# EAGLE design FET_bord (EAGLE 8.2.2)
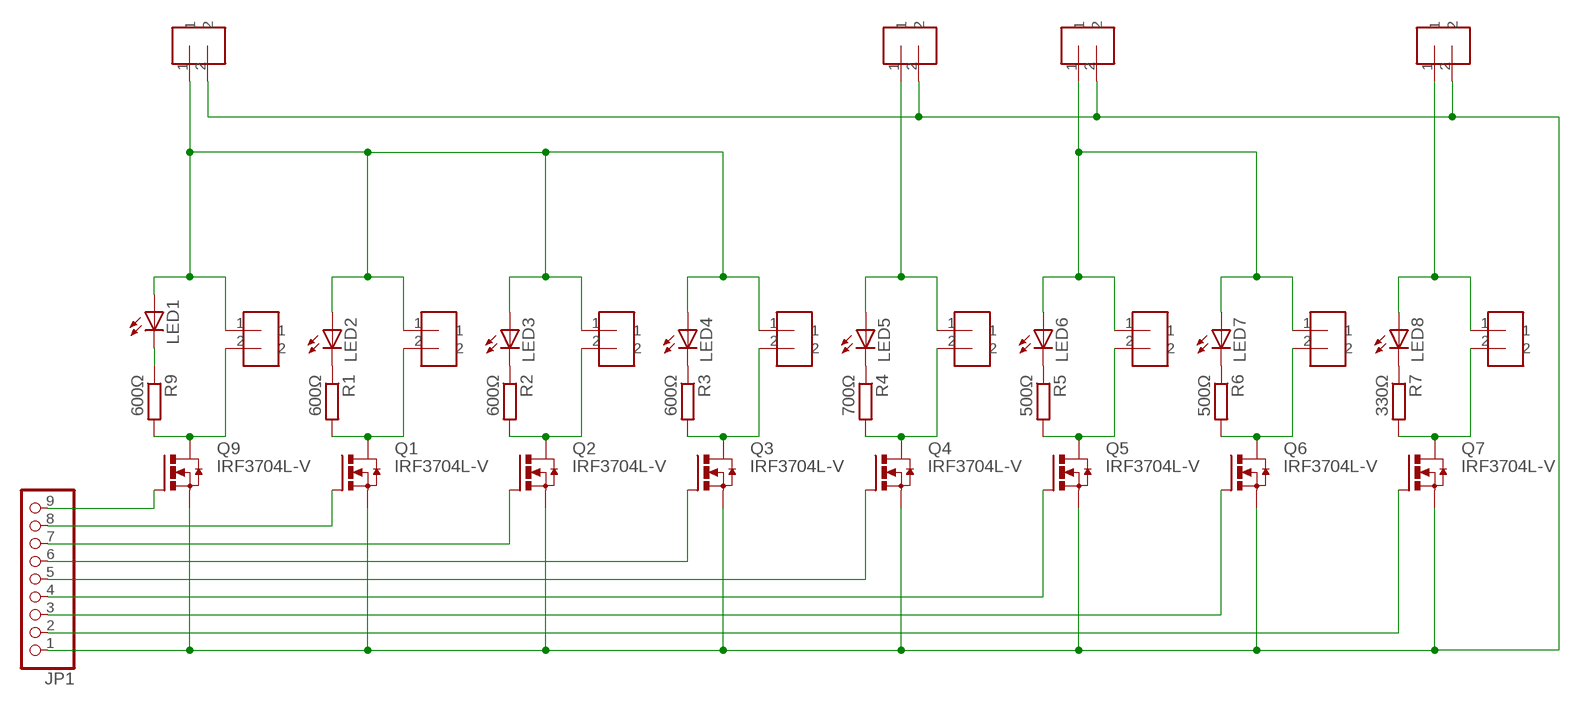
[diagram p0: schematic, sheet 1]

## Parts
3.3V  TERMINAL_BLOCK_5.08MM  [TERMINAL_BLOCK_5.8MM]
5V  TERMINAL_BLOCK_5.08MM  [TERMINAL_BLOCK_5.8MM]
7V  TERMINAL_BLOCK_5.08MM  [TERMINAL_BLOCK_5.8MM]
12V  TERMINAL_BLOCK_5.08MM  [TERMINAL_BLOCK_5.8MM]
JP1  PINHD-1X9  [1X09]
LED1  LED3MM  [LED3MM]
LED2  LED3MM  [LED3MM]
LED3  LED3MM  [LED3MM]
LED4  LED3MM  [LED3MM]
LED5  LED3MM  [LED3MM]
LED6  LED3MM  [LED3MM]
LED7  LED3MM  [LED3MM]
LED8  LED3MM  [LED3MM]
Q1  IRF3704L-V  [TO262-V]
Q2  IRF3704L-V  [TO262-V]
Q3  IRF3704L-V  [TO262-V]
Q4  IRF3704L-V  [TO262-V]
Q5  IRF3704L-V  [TO262-V]
Q6  IRF3704L-V  [TO262-V]
Q7  IRF3704L-V  [TO262-V]
Q9  IRF3704L-V  [TO262-V]
R1  600Ω  R-EU_0207/15  [0207/15]
R2  600Ω  R-EU_0207/15  [0207/15]
R3  600Ω  R-EU_0207/15  [0207/15]
R4  700Ω  R-EU_0207/15  [0207/15]
R5  500Ω  R-EU_0207/15  [0207/15]
R6  500Ω  R-EU_0207/15  [0207/15]
R7  330Ω  R-EU_0207/15  [0207/15]
R9  600Ω  R-EU_0207/15  [0207/15]
U$1  TERMINAL_BLOCK_5.08MM  [TERMINAL_BLOCK_5.8MM]
U$2  TERMINAL_BLOCK_5.08MM  [TERMINAL_BLOCK_5.8MM]
U$3  TERMINAL_BLOCK_5.08MM  [TERMINAL_BLOCK_5.8MM]
U$4  TERMINAL_BLOCK_5.08MM  [TERMINAL_BLOCK_5.8MM]
U$5  TERMINAL_BLOCK_5.08MM  [TERMINAL_BLOCK_5.8MM]
U$6  TERMINAL_BLOCK_5.08MM  [TERMINAL_BLOCK_5.8MM]
U$7  TERMINAL_BLOCK_5.08MM  [TERMINAL_BLOCK_5.8MM]
U$8  TERMINAL_BLOCK_5.08MM  [TERMINAL_BLOCK_5.8MM]

## Nets
N$1: LED2.K(C) R1.1
N$2: 12V.1 LED1.A LED2.A LED3.A LED4.A U$1.1 U$2.1 U$3.1 U$4.1
N$3: Q1.2(D) R1.2 U$2.2
N$4: LED3.K(C) R2.1
N$5: LED4.K(C) R3.1
N$6: Q2.2(D) R2.2 U$3.2
N$7: LED5.K(C) R4.1
N$8: LED8.K(C) R7.1
N$9: LED1.K(C) R9.1
N$10: LED7.K(C) R6.1
N$11: Q9.2(D) R9.2 U$1.2
N$12: Q3.2(D) R3.2 U$4.2
N$13: LED6.K(C) R5.1
N$14: 7V.1 LED5.A U$5.1
N$15: Q4.2(D) R4.2 U$5.2
N$18: Q5.2(D) R5.2 U$6.2
N$20: 5V.1 LED6.A LED7.A U$6.1 U$7.1
N$21: Q6.2(D) R6.2 U$7.2
N$23: 3.3V.1 LED8.A U$8.1
N$24: Q7.2(D) R7.2 U$8.2
N$25: JP1.9 Q9.1(G)
N$26: JP1.8 Q1.1(G)
N$27: JP1.7 Q2.1(G)
N$28: JP1.6 Q3.1(G)
N$29: JP1.5 Q4.1(G)
N$30: JP1.4 Q5.1(G)
N$31: JP1.3 Q6.1(G)
N$32: JP1.2 Q7.1(G)
N$33: 3.3V.2 5V.2 7V.2 12V.2 JP1.1 Q1.3(S) Q2.3(S) Q3.3(S) Q4.3(S) Q5.3(S) Q6.3(S) Q7.3(S) Q9.3(S)

## Library data of the parts
3.3V 5V 7V 12V U$1-U$8 = Terminal_Block_5.08mm:TERMINAL_BLOCK_5.08MM
JP1 = pinhead:PINHD-1X9: PIN HEADER
LED1-LED8 = adafruit:LED: LED OSRAM: - CHIPLED LG R971, LG N971, LY N971, LG Q971, LY Q971, LO R971, LY R971 LH N974, LH R974 LS Q976, LO Q976, LY Q976 LO Q996 - Hyper CHIPLED LW Q18S LB Q993, LB Q99A, LB R99A - SideLED LS A670, LO A670, LY A670, LG A670, LP A670 LB A673, LV A673, LT A673, LW A673 LH A674 LY A675 LS A676, LA A676, LO A676, LY A676, LW A676 LS A679, LY A679, LG A679 - Hyper Micro SIDELED® LS Y876, LA Y876, LO Y876, LY Y876 LT Y87S - SmartLED LW L88C, LW L88S LB L89C, LB L89S, LG L890 LS L89K, LO L89K, LY L89K LS L896, LA L896, LO L896, LY L896 - TOPLED LS T670, LO T670, LY T670, LG T670, LP T670 LSG T670, LSP T670, LSY T670, LOP T670, LYG T670 LG T671, LOG T671, LSG T671 LB T673, LV T673, LT T673, LW T673 LH T674 LS T676, LA T676, LO T676, LY T676, LB T676, LH T676, LSB T676, LW T676 LB T67C, LV T67C, LT T67C, LS T67K, LO T67K, LY T67K, LW E67C LS E67B, LA E67B, LO E67B, LY E67B, LB E67C, LV E67C, LT E67C LW T67C LS T679, LY T679, LG T679 LS T770, LO T770, LY T770, LG T770, LP T770 LB T773, LV T773, LT T773, LW T773 LH T774 LS E675, LA E675, LY E675, LS T675 LS T776, LA T776, LO T776, LY T776, LB T776 LHGB T686 LT T68C, LB T68C - Hyper Mini TOPLED® LB M676 - Mini TOPLED Santana® LG M470 LS M47K, LO M47K, LY M47K Source: http://www.osram.convergy.de/
Q1-Q7 Q9 = transistor-power:IRF3704: SMPS MOSFET HEXFET® Power MOSFET Source: http://www.irf.com/product-info/datasheets/data/irf3704.pdf
R1-R7 R9 = resistor:R-EU_: RESISTOR, European symbol

## Net classes
0 default: width 1 mm, clearance 0.4 mm

## Board
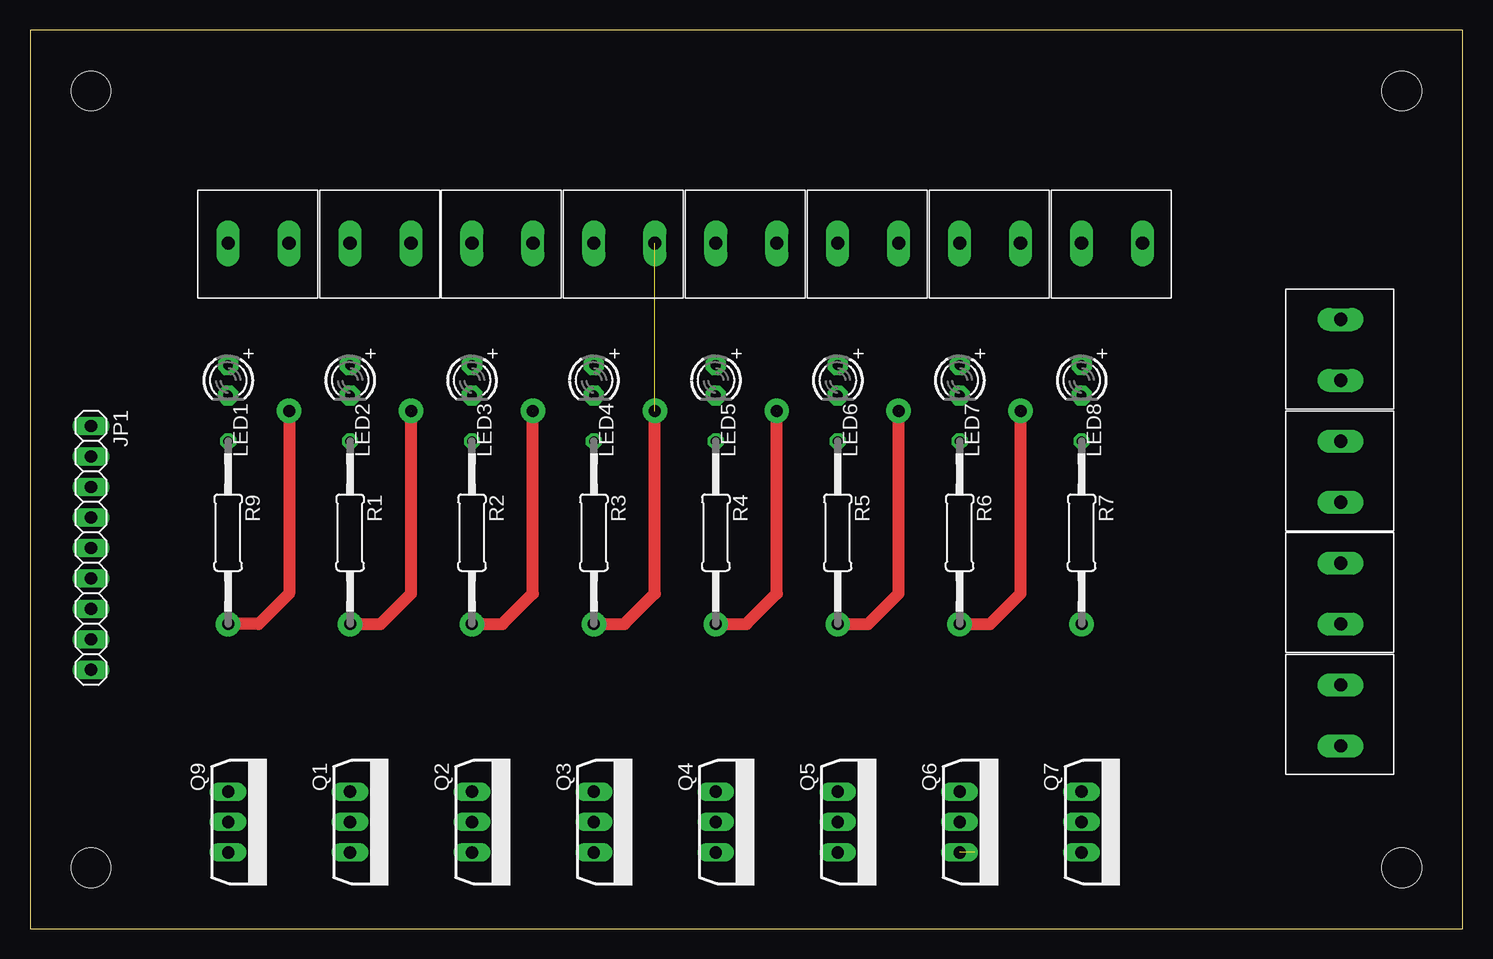
[diagram p1: board, top side]
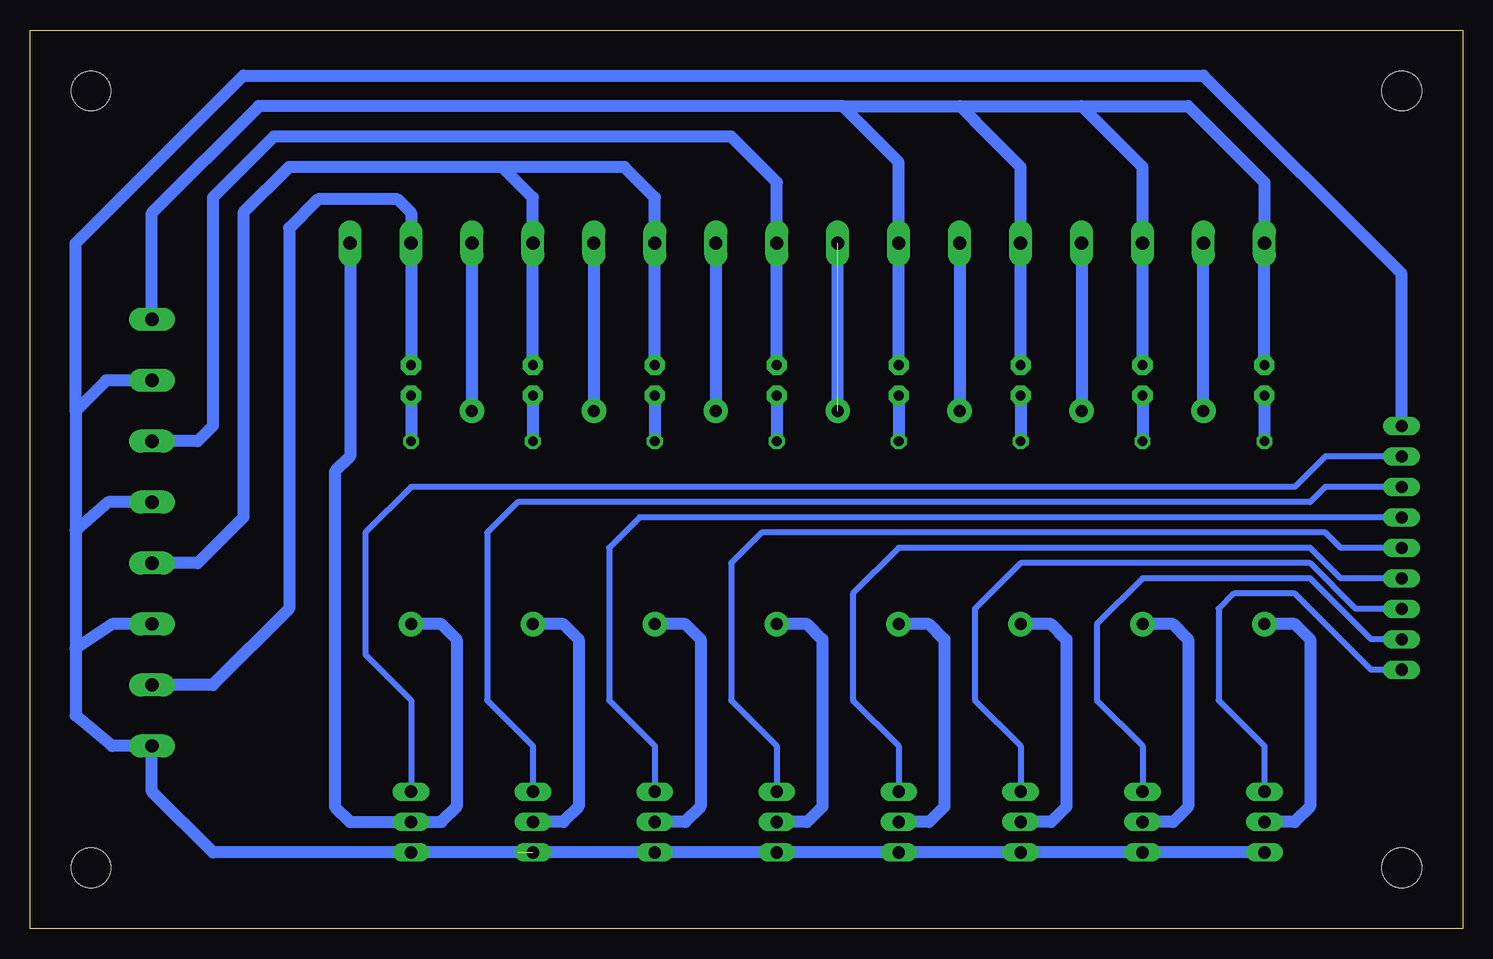
[diagram p2: board, bottom side, seen from below]

Size 119.38 x 74.93 mm. Coordinates in mm from the lower left corner, seen from the top.
Outline: 0,0 119.38,0 119.38,74.93 0,74.92 0,0
Copper layers (1*16): Top 0.035mm / dielectric 1.5mm / Bottom 0.035mm
Design rules "default": minimum track width 6mil, minimum drill 0.35mm, track to track 6mil, track to pad 6mil, pad to pad 6mil, via to via 6mil, smd to smd 6mil, copper to edge 40mil, drill to drill 6mil, minimum pad ring 10mil, minimum via ring 8mil, stop-mask expansion 4mil, vias tented up to drill 0mil, thermal gap 10mil
Holes 3.3 mm at 5.08,5.08 114.3,5.08 114.3,69.85 5.08,69.85

### Footprints (pad centres in the part's own frame; a part is rotated, then mirrored left to right if it is on the bottom)
TERMINAL_BLOCK_5.8MM = drill 1.1 pad 1.93 long: 1 0,0; 2 5.08,0
1X09 = drill 1.016 long: 1 -10.16,0; 2 -7.62,0; 3 -5.08,0; 4 -2.54,0; 5 0,0; 6 2.54,0; 7 5.08,0; 8 7.62,0; 9 10.16,0
LED3MM = drill 0.813 pad 1.676 octagon: A -1.27,0; K 1.27,0
TO262-V = drill 1.016 long: 1 -2.54,0; 2 0,0; 3 2.54,0
0207/15 = drill 0.813 octagon: 1 -7.62,0; 2 7.62,0

### Placement (x,y rotation side)
3.3V  109.22,20.32 270 top
5V  109.22,30.48 270 top
7V  109.22,40.64 270 top
12V  109.22,50.8 270 top
JP1  5.08,31.75 270 top
LED1  16.51,45.72 270 top
LED2  26.67,45.72 270 top
LED3  36.83,45.72 270 top
LED4  46.99,45.72 270 top
LED5  57.15,45.72 270 top
LED6  67.31,45.72 270 top
LED7  77.47,45.72 270 top
LED8  87.63,45.72 270 top
Q1  26.67,8.89 270 top
Q2  36.83,8.89 270 top
Q3  46.99,8.89 270 top
Q4  57.15,8.89 270 top
Q5  67.31,8.89 270 top
Q6  77.47,8.89 270 top
Q7  87.63,8.89 270 top
Q9  16.51,8.89 270 top
R1  26.67,33.02 270 top
R2  36.83,33.02 270 top
R3  46.99,33.02 270 top
R4  57.15,33.02 270 top
R5  67.31,33.02 270 top
R6  77.47,33.02 270 top
R7  87.63,33.02 270 top
R9  16.51,33.02 270 top
U$1  16.51,57.15 0 top
U$2  26.67,57.15 0 top
U$3  36.83,57.15 0 top
U$4  46.99,57.15 0 top
U$5  57.15,57.15 0 top
U$6  67.31,57.15 0 top
U$7  77.47,57.15 0 top
U$8  87.63,57.15 0 top

### Tracks (layer width: path | path; a pad name or v marks a point on that pad's centre or on a via)
N$1
  Bottom 1.016: LED2.K R1.1
N$2
  Bottom 1.016: LED1.A U$1.1 16.51,62.23 22.86,68.58 31.75,68.58 | LED2.A U$2.1 26.67,63.5 31.75,68.58 | LED3.A U$3.1 36.83,63.49 40.65,67.31 40.65,67.36 41.86,68.58 | LED4.A U$4.1 46.99,63.9 51.67,68.58 | 41.86,68.58 31.75,68.58 | 51.67,68.58 41.86,68.58 | 51.67,68.58 100.33,68.58 109.22,59.69 12V.1
N$3  (1 unrouted)
  Top 1.016: R1.2 29.21,25.4 31.75,27.94 31.75,43.18
  Bottom 1.016: Q1.2 24.13,8.89 22.86,10.16 22.86,24.13 24.13,25.4 R1.2 | U$2.2 31.75,43.18
N$4
  Bottom 1.016: LED3.K R2.1
N$5
  Bottom 1.016: LED4.K R3.1
N$6  (1 unrouted)
  Top 1.016: R2.2 39.37,25.4 41.91,27.94 41.91,43.18
  Bottom 1.016: Q2.2 34.29,8.89 33.02,10.16 33.02,24.13 34.29,25.4 R2.2 | U$3.2 41.91,43.18
N$7
  Bottom 1.016: LED5.K R4.1
N$8
  Bottom 1.016: LED8.K R7.1
N$9
  Bottom 1.016: LED1.K R9.1
N$10
  Bottom 1.016: LED7.K R6.1
N$11  (via drill 1 pad 2.03)
  Top 1.016: v21.59,43.18 21.59,27.94 19.05,25.4 R9.2
  Bottom 1.016: Q9.2 13.97,8.89 12.7,10.16 12.7,24.13 13.97,25.4 R9.2 | v21.59,43.18 U$1.2
N$12  (1 unrouted)
  Top 1.016: R3.2 49.53,25.4 52.07,27.94 52.07,43.18
  Bottom 1.016: Q3.2 44.45,8.89 43.18,10.16 43.18,24.13 44.45,25.4 R3.2
N$13
  Bottom 1.016: LED6.K R5.1
N$14
  Bottom 1.016: LED5.A U$5.1 57.15,62.23 60.96,66.04 99.06,66.04 104.14,60.96 104.14,41.91 105.41,40.64 7V.1
N$15  (1 unrouted)
  Top 1.016: R4.2 59.69,25.4 62.23,27.94 62.23,43.18
  Bottom 1.016: Q4.2 54.61,8.89 53.34,10.16 53.34,24.13 54.61,25.4 R4.2 | U$5.2 62.23,43.18
N$18  (1 unrouted)
  Top 1.016: R5.2 69.85,25.4 72.39,27.94 72.39,43.18
  Bottom 1.016: Q5.2 64.77,8.89 63.5,10.16 63.5,24.13 64.77,25.4 R5.2 | U$6.2 72.39,43.18
N$20
  Bottom 1.016: 5V.1 105.41,30.48 101.6,34.29 101.6,59.69 97.79,63.5 80.01,63.5 | LED6.A U$6.1 67.31,60.96 69.85,63.5 80.01,63.5 | LED7.A U$7.1 77.47,60.96 80.01,63.5
N$21  (1 unrouted)
  Top 1.016: R6.2 80.01,25.4 82.55,27.94 82.55,43.18
  Bottom 1.016: Q6.2 74.93,8.89 73.66,10.16 73.66,24.13 74.93,25.4 R6.2 | U$7.2 82.55,43.18
N$23
  Bottom 1.016: LED8.A U$8.1 87.63,59.69 88.75,60.81 95.4,60.81 97.79,58.42 97.79,26.67 104.14,20.32 3.3V.1
N$24
  Bottom 1.016: R7.2 85.09,25.4 83.82,24.13 83.82,10.16 85.09,8.89 Q7.2 92.71,8.89 93.98,10.16 93.98,38.1 92.71,39.37 U$8.2
N$25
  Bottom 0.508: JP1.9 7.62,21.59 13.97,27.94 19.05,27.94 20.32,26.67 20.32,19.05 16.51,15.24 Q9.1
N$26
  Bottom 0.508: JP1.8 7.62,24.13 12.7,29.21 26.67,29.21 30.48,25.4 30.48,19.05 26.67,15.24 Q1.1
N$27
  Bottom 0.508: JP1.7 8.89,26.67 12.7,30.48 36.83,30.48 40.64,26.67 40.64,19.05 36.83,15.24 Q2.1
N$28
  Bottom 0.508: JP1.6 10.16,29.21 12.7,31.75 46.99,31.75 50.8,27.94 50.8,19.05 46.99,15.24 Q3.1
N$29
  Bottom 0.508: JP1.5 10.16,31.75 11.43,33.02 58.42,33.02 60.96,30.48 60.96,19.05 57.15,15.24 Q4.1
N$30
  Bottom 0.508: JP1.4 68.58,34.29 71.12,31.75 71.12,19.05 67.31,15.24 Q5.1
N$31
  Bottom 0.508: Q6.1 77.47,15.24 81.28,19.05 81.28,33.02 78.74,35.56 12.7,35.56 11.43,36.83 JP1.3
N$32
  Bottom 0.508: JP1.2 11.43,39.37 13.97,36.83 87.63,36.83 91.44,33.02 91.44,22.86 87.63,19.05 Q7.1
N$33  (1 unrouted)
  Bottom 1.016: 115.57,23.35 115.57,17.78 112.53,15.24 3.3V.2 109.22,11.43 104.14,6.35 Q7.3 Q6.3 | 115.57,33.2 115.57,23.35 | 115.57,43.18 115.57,33.2 | 115.57,43.18 115.57,57.15 101.6,71.12 21.59,71.12 5.08,54.61 JP1.1 | Q9.3 Q1.3 Q2.3 Q3.3 Q4.3 Q5.3 78.74,6.35 | 5V.2 112.54,25.4 115.57,23.35 | 7V.2 112.85,35.56 115.57,33.2 | 12V.2 113.03,45.72 115.57,43.18
N$34  (via drill 1 pad 2.03)
  other vias: 62.23,43.18
N$35  (via drill 1 pad 2.03)
  other vias: 72.39,43.18
N$36  (via drill 1 pad 2.03)
  other vias: 82.55,43.18
N$37  (via drill 1 pad 2.03)
  other vias: 16.51,25.4
N$38  (via drill 1 pad 2.03)
  other vias: 26.67,25.4
N$39  (via drill 1 pad 2.03)
  other vias: 36.83,25.4
N$40  (via drill 1 pad 2.03)
  other vias: 46.99,25.4
N$41  (via drill 1 pad 2.03)
  other vias: 87.63,25.4
N$42  (via drill 1 pad 2.03)
  other vias: 57.15,25.4
N$43  (via drill 1 pad 2.03)
  other vias: 67.31,25.4
N$44  (via drill 1 pad 2.03)
  other vias: 77.47,25.4
N$45  (via drill 1 pad 2.03)
  Bottom 1.016: v52.07,43.18 52.07,57.15
N$46  (via drill 1 pad 2.03)
  other vias: 41.91,43.18
N$48  (via drill 1 pad 2.03)
  other vias: 31.75,43.18